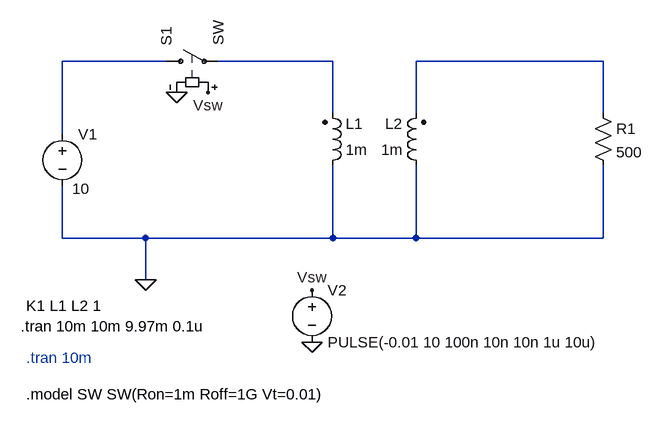
[diagram p0: schematic prof_08_exitation_current_switch.asc]
prof_08_exitation_current_switch.asc, the LTspice schematic file:
Version 4
SHEET 1 1120 736
WIRE 336 208 176 208
WIRE 592 208 416 208
WIRE 1008 208 720 208
WIRE 592 288 592 208
WIRE 720 288 720 208
WIRE 1008 288 1008 208
WIRE 176 320 176 208
WIRE 176 480 176 400
WIRE 304 480 176 480
WIRE 592 480 592 368
WIRE 592 480 304 480
WIRE 720 480 720 368
WIRE 720 480 592 480
WIRE 1008 480 1008 368
WIRE 1008 480 720 480
WIRE 304 544 304 480
FLAG 304 544 0
FLAG 560 560 Vsw
FLAG 560 640 0
FLAG 400 256 Vsw
FLAG 352 256 0
SYMBOL ind2 576 384 M180
WINDOW 0 36 80 Left 2
WINDOW 3 36 40 Left 2
SYMATTR InstName L1
SYMATTR Value 1m
SYMBOL ind2 736 384 R180
WINDOW 0 36 80 Left 2
WINDOW 3 36 40 Left 2
SYMATTR InstName L2
SYMATTR Value 1m
SYMBOL res 992 272 R0
SYMATTR InstName R1
SYMATTR Value 500
SYMBOL voltage 176 304 R0
WINDOW 3 15 100 Left 2
SYMATTR Value 10
SYMATTR InstName V1
SYMATTR SpiceLine Rser=0.001m
SYMBOL voltage 560 544 R0
SYMATTR InstName V2
SYMATTR Value PULSE(-0.01 10 100n 10n 10n 1u 10u)
SYMBOL sw 320 208 R270
SYMATTR InstName S1
TEXT 120 584 Left 2 !K1 L1 L2 1
TEXT 112 616 Left 2 !.tran 10m 10m 9.97m 0.1u
TEXT 120 664 Left 2 ;.tran 10m
TEXT 120 720 Left 2 !.model SW SW(Ron=1m Roff=1G Vt=0.01)

The netlist it stands for:
* prof_08_exitation_current_switch.asc
L1 0 N002 1m
L2 0 N003 1m
R1 N003 0 500
V1 N001 0 10 Rser=0.001m
V2 Vsw 0 PULSE(-0.01 10 100n 10n 10n 1u 10u)
S1 N001 N002 Vsw 0 SW
K1 L1 L2 1
.tran 10m 10m 9.97m 0.1u
* .tran 10m
.model SW SW(Ron=1m Roff=1G Vt=0.01)
.backanno
.end